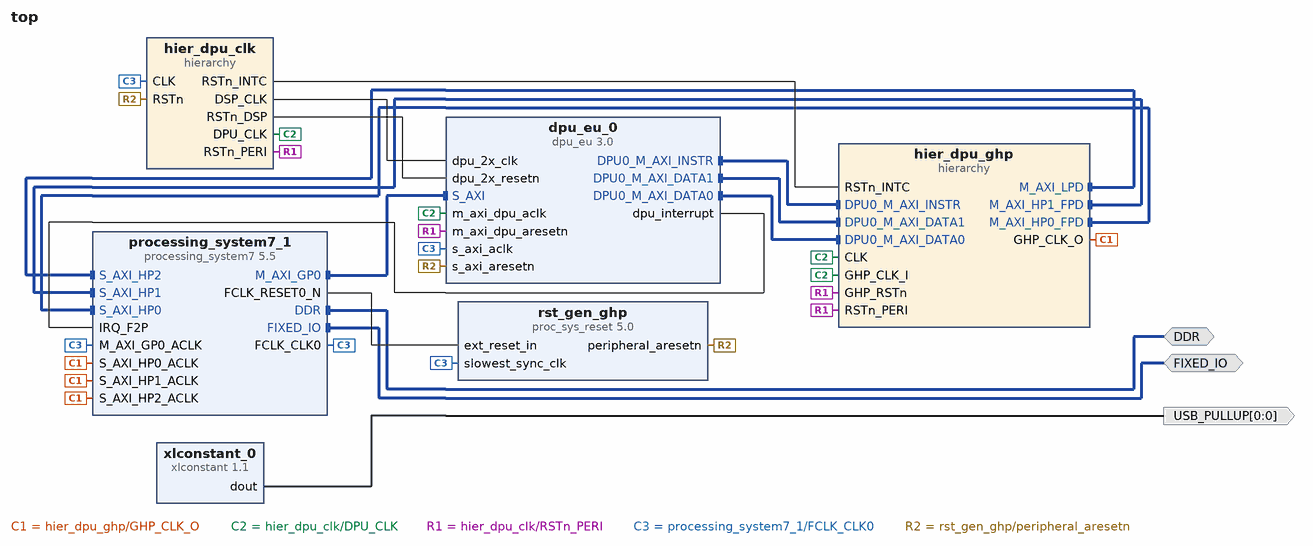
[diagram p0: block diagram of the top level]
# Vivado block design top, xc7z020clg484-1, Vivado 2019.2
create_bd_design top

create_bd_intf_port -mode Master -vlnv xilinx.com:interface:ddrx_rtl:1.0 DDR
create_bd_intf_port -mode Master -vlnv xilinx.com:display_processing_system7:fixedio_rtl:1.0 FIXED_IO
create_bd_port -dir O -from 0 -to 0 USB_PULLUP

create_bd_cell -type hier hier_dpu_clk
create_bd_cell -type hier hier_dpu_ghp
create_bd_cell -type ip -vlnv xilinx.com:ip:processing_system7:5.5 processing_system7_1
set_property -dict [list \
  CONFIG.PCW_APU_PERIPHERAL_FREQMHZ 666.666667 \
  CONFIG.PCW_ENET0_ENET0_IO {MIO 16 .. 27} \
  CONFIG.PCW_ENET0_GRP_MDIO_ENABLE 1 \
  CONFIG.PCW_ENET0_GRP_MDIO_IO {MIO 52 .. 53} \
  CONFIG.PCW_ENET0_PERIPHERAL_ENABLE 1 \
  CONFIG.PCW_ENET0_RESET_ENABLE 0 \
  CONFIG.PCW_ENET_RESET_ENABLE 1 \
  CONFIG.PCW_ENET_RESET_SELECT {Share reset pin} \
  CONFIG.PCW_FPGA0_PERIPHERAL_FREQMHZ 100 \
  CONFIG.PCW_FPGA1_PERIPHERAL_FREQMHZ 150.000000 \
  CONFIG.PCW_GPIO_MIO_GPIO_ENABLE 1 \
  CONFIG.PCW_GPIO_MIO_GPIO_IO MIO \
  CONFIG.PCW_I2C_RESET_ENABLE 1 \
  CONFIG.PCW_IRQ_F2P_INTR 1 \
  CONFIG.PCW_PRESET_BANK1_VOLTAGE {LVCMOS 1.8V} \
  CONFIG.PCW_QSPI_GRP_SINGLE_SS_ENABLE 1 \
  CONFIG.PCW_QSPI_GRP_SINGLE_SS_IO {MIO 1 .. 6} \
  CONFIG.PCW_QSPI_PERIPHERAL_ENABLE 1 \
  CONFIG.PCW_QSPI_QSPI_IO {MIO 1 .. 6} \
  CONFIG.PCW_SD0_GRP_CD_ENABLE 1 \
  CONFIG.PCW_SD0_GRP_CD_IO {MIO 47} \
  CONFIG.PCW_SD0_GRP_WP_ENABLE 1 \
  CONFIG.PCW_SD0_GRP_WP_IO {MIO 46} \
  CONFIG.PCW_SD0_PERIPHERAL_ENABLE 1 \
  CONFIG.PCW_SD0_SD0_IO {MIO 40 .. 45} \
  CONFIG.PCW_SDIO_PERIPHERAL_FREQMHZ 50 \
  CONFIG.PCW_SINGLE_QSPI_DATA_MODE x4 \
  CONFIG.PCW_TTC0_PERIPHERAL_ENABLE 1 \
  CONFIG.PCW_TTC0_TTC0_IO EMIO \
  CONFIG.PCW_UART1_PERIPHERAL_ENABLE 1 \
  CONFIG.PCW_UART1_UART1_IO {MIO 48 .. 49} \
  CONFIG.PCW_UART_PERIPHERAL_FREQMHZ 50 \
  CONFIG.PCW_UIPARAM_DDR_FREQ_MHZ 533.333313 \
  CONFIG.PCW_UIPARAM_DDR_PARTNO {MT41J128M16 HA-15E} \
  CONFIG.PCW_USB0_PERIPHERAL_ENABLE 1 \
  CONFIG.PCW_USB0_RESET_ENABLE 0 \
  CONFIG.PCW_USB0_USB0_IO {MIO 28 .. 39} \
  CONFIG.PCW_USB_RESET_ENABLE 1 \
  CONFIG.PCW_USB_RESET_SELECT {Share reset pin} \
  CONFIG.PCW_USE_FABRIC_INTERRUPT 1 \
  CONFIG.PCW_USE_S_AXI_HP0 1 \
  CONFIG.PCW_USE_S_AXI_HP1 1 \
  CONFIG.PCW_USE_S_AXI_HP2 1 \
  CONFIG.preset ZedBoard \
] [get_bd_cells processing_system7_1]
# 223 more settings of processing_system7_1 are not shown: defaults, MIO pin electricals, DDR timing, and values the tool derives
create_bd_cell -type ip -vlnv xilinx.com:ip:proc_sys_reset:5.0 rst_gen_ghp
create_bd_cell -type ip -vlnv xilinx.com:ip:xlconstant:1.1 xlconstant_0
create_bd_cell -type ip -vlnv xilinx.com:ip:dpu_eu:3.0 dpu_eu_0
set_property -dict [list \
  CONFIG.ARCH 1152 \
  CONFIG.TIME_DAY 14 \
  CONFIG.TIME_HOUR 0 \
  CONFIG.TIME_MONTH 1 \
  CONFIG.TIME_QUARTER 0 \
  CONFIG.TIME_YEAR 21 \
] [get_bd_cells dpu_eu_0]

# ---- hierarchy /hier_dpu_clk ----
current_bd_instance /hier_dpu_clk
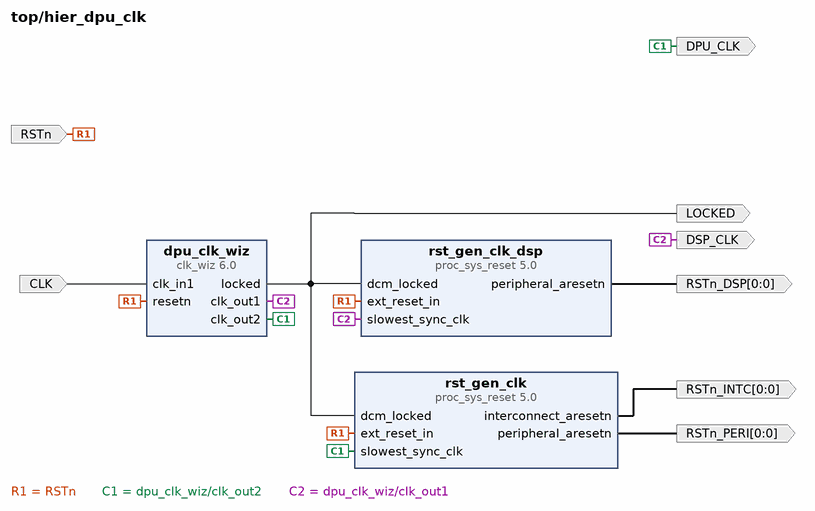
[diagram p1: block diagram inside /hier_dpu_clk]
create_bd_pin -dir I -type clk CLK
create_bd_pin -dir O -type clk DPU_CLK
create_bd_pin -dir O -type clk DSP_CLK
create_bd_pin -dir O -type data LOCKED
create_bd_pin -dir I -type rst RSTn
create_bd_pin -dir O -from 0 -to 0 -type rst RSTn_DSP
create_bd_pin -dir O -from 0 -to 0 -type rst RSTn_INTC
create_bd_pin -dir O -from 0 -to 0 -type rst RSTn_PERI

create_bd_cell -type ip -vlnv xilinx.com:ip:clk_wiz:6.0 dpu_clk_wiz
set_property -dict [list \
  CONFIG.CLKIN1_JITTER_PS 100.0 \
  CONFIG.CLKOUT1_DRIVES BUFG \
  CONFIG.CLKOUT1_JITTER 224.262 \
  CONFIG.CLKOUT1_PHASE_ERROR 296.868 \
  CONFIG.CLKOUT1_REQUESTED_OUT_FREQ 180 \
  CONFIG.CLKOUT2_DRIVES BUFG \
  CONFIG.CLKOUT2_JITTER 247.412 \
  CONFIG.CLKOUT2_PHASE_ERROR 296.868 \
  CONFIG.CLKOUT2_REQUESTED_OUT_FREQ 90 \
  CONFIG.CLKOUT2_USED true \
  CONFIG.CLKOUT3_DRIVES BUFG \
  CONFIG.CLKOUT4_DRIVES BUFG \
  CONFIG.CLKOUT5_DRIVES BUFG \
  CONFIG.CLKOUT6_DRIVES BUFG \
  CONFIG.CLKOUT7_DRIVES BUFG \
  CONFIG.MMCM_CLKFBOUT_MULT_F 49.500 \
  CONFIG.MMCM_CLKIN1_PERIOD 10.000 \
  CONFIG.MMCM_CLKOUT0_DIVIDE_F 5.500 \
  CONFIG.MMCM_CLKOUT1_DIVIDE 11 \
  CONFIG.MMCM_DIVCLK_DIVIDE 5 \
  CONFIG.NUM_OUT_CLKS 2 \
  CONFIG.RESET_PORT resetn \
  CONFIG.RESET_TYPE ACTIVE_LOW \
  CONFIG.SECONDARY_SOURCE Single_ended_clock_capable_pin \
  CONFIG.USE_PHASE_ALIGNMENT true \
] [get_bd_cells dpu_clk_wiz]
create_bd_cell -type ip -vlnv xilinx.com:ip:proc_sys_reset:5.0 rst_gen_clk
create_bd_cell -type ip -vlnv xilinx.com:ip:proc_sys_reset:5.0 rst_gen_clk_dsp

# ---- hierarchy /hier_dpu_ghp ----
current_bd_instance /hier_dpu_ghp
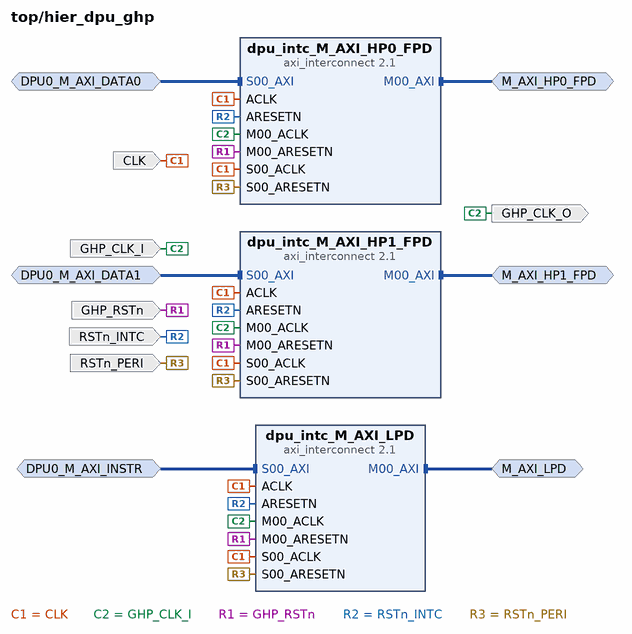
[diagram p2: block diagram inside /hier_dpu_ghp]
create_bd_intf_pin -mode Slave -vlnv xilinx.com:interface:aximm_rtl:1.0 DPU0_M_AXI_DATA0
create_bd_intf_pin -mode Slave -vlnv xilinx.com:interface:aximm_rtl:1.0 DPU0_M_AXI_DATA1
create_bd_intf_pin -mode Slave -vlnv xilinx.com:interface:aximm_rtl:1.0 DPU0_M_AXI_INSTR
create_bd_intf_pin -mode Master -vlnv xilinx.com:interface:aximm_rtl:1.0 M_AXI_HP0_FPD
create_bd_intf_pin -mode Master -vlnv xilinx.com:interface:aximm_rtl:1.0 M_AXI_HP1_FPD
create_bd_intf_pin -mode Master -vlnv xilinx.com:interface:aximm_rtl:1.0 M_AXI_LPD
create_bd_pin -dir I -type clk CLK
create_bd_pin -dir I -type clk GHP_CLK_I
create_bd_pin -dir O -type clk GHP_CLK_O
create_bd_pin -dir I -type rst GHP_RSTn
create_bd_pin -dir I -type rst RSTn_INTC
create_bd_pin -dir I -type rst RSTn_PERI

create_bd_cell -type ip -vlnv xilinx.com:ip:axi_interconnect:2.1 dpu_intc_M_AXI_HP0_FPD
set_property -dict {CONFIG.NUM_MI 1 CONFIG.NUM_SI 1} [get_bd_cells dpu_intc_M_AXI_HP0_FPD]
create_bd_cell -type ip -vlnv xilinx.com:ip:axi_interconnect:2.1 dpu_intc_M_AXI_HP1_FPD
set_property -dict {CONFIG.NUM_MI 1 CONFIG.NUM_SI 1} [get_bd_cells dpu_intc_M_AXI_HP1_FPD]
create_bd_cell -type ip -vlnv xilinx.com:ip:axi_interconnect:2.1 dpu_intc_M_AXI_LPD
set_property -dict {CONFIG.NUM_MI 1 CONFIG.NUM_SI 1} [get_bd_cells dpu_intc_M_AXI_LPD]

# ---- connections ----

current_bd_instance /hier_dpu_clk
connect_bd_net [get_bd_pins CLK] [get_bd_pins dpu_clk_wiz/clk_in1]
connect_bd_net [get_bd_pins RSTn] [get_bd_pins dpu_clk_wiz/resetn] [get_bd_pins rst_gen_clk/ext_reset_in] [get_bd_pins rst_gen_clk_dsp/ext_reset_in]
connect_bd_net -net dpu_clk_wiz_clk_dpu [get_bd_pins dpu_clk_wiz/clk_out2] [get_bd_pins DPU_CLK] [get_bd_pins rst_gen_clk/slowest_sync_clk]
connect_bd_net -net dpu_clk_wiz_clk_dsp [get_bd_pins dpu_clk_wiz/clk_out1] [get_bd_pins DSP_CLK] [get_bd_pins rst_gen_clk_dsp/slowest_sync_clk]
connect_bd_net [get_bd_pins dpu_clk_wiz/locked] [get_bd_pins LOCKED] [get_bd_pins rst_gen_clk/dcm_locked] [get_bd_pins rst_gen_clk_dsp/dcm_locked]
connect_bd_net [get_bd_pins rst_gen_clk_dsp/peripheral_aresetn] [get_bd_pins RSTn_DSP]
connect_bd_net [get_bd_pins rst_gen_clk/interconnect_aresetn] [get_bd_pins RSTn_INTC]
connect_bd_net [get_bd_pins rst_gen_clk/peripheral_aresetn] [get_bd_pins RSTn_PERI]

current_bd_instance /hier_dpu_ghp
connect_bd_intf_net [get_bd_intf_pins DPU0_M_AXI_INSTR] [get_bd_intf_pins dpu_intc_M_AXI_LPD/S00_AXI]
connect_bd_intf_net -intf_net DPU0_M_AXI_DATA1_1 [get_bd_intf_pins DPU0_M_AXI_DATA1] [get_bd_intf_pins dpu_intc_M_AXI_HP1_FPD/S00_AXI]
connect_bd_intf_net [get_bd_intf_pins M_AXI_HP1_FPD] [get_bd_intf_pins dpu_intc_M_AXI_HP1_FPD/M00_AXI]
connect_bd_intf_net [get_bd_intf_pins M_AXI_LPD] [get_bd_intf_pins dpu_intc_M_AXI_LPD/M00_AXI]
connect_bd_intf_net [get_bd_intf_pins M_AXI_HP0_FPD] [get_bd_intf_pins dpu_intc_M_AXI_HP0_FPD/M00_AXI]
connect_bd_intf_net -intf_net DPU0_M_AXI_DATA0_1 [get_bd_intf_pins DPU0_M_AXI_DATA0] [get_bd_intf_pins dpu_intc_M_AXI_HP0_FPD/S00_AXI]
connect_bd_net [get_bd_pins CLK] \
  [get_bd_pins dpu_intc_M_AXI_HP0_FPD/ACLK] [get_bd_pins dpu_intc_M_AXI_HP0_FPD/S00_ACLK] \
  [get_bd_pins dpu_intc_M_AXI_HP1_FPD/ACLK] [get_bd_pins dpu_intc_M_AXI_HP1_FPD/S00_ACLK] \
  [get_bd_pins dpu_intc_M_AXI_LPD/ACLK] [get_bd_pins dpu_intc_M_AXI_LPD/S00_ACLK]
connect_bd_net [get_bd_pins GHP_CLK_I] \
  [get_bd_pins GHP_CLK_O] [get_bd_pins dpu_intc_M_AXI_HP0_FPD/M00_ACLK] [get_bd_pins dpu_intc_M_AXI_HP1_FPD/M00_ACLK] \
  [get_bd_pins dpu_intc_M_AXI_LPD/M00_ACLK]
connect_bd_net [get_bd_pins GHP_RSTn] \
  [get_bd_pins dpu_intc_M_AXI_HP0_FPD/M00_ARESETN] [get_bd_pins dpu_intc_M_AXI_HP1_FPD/M00_ARESETN] \
  [get_bd_pins dpu_intc_M_AXI_LPD/M00_ARESETN]
connect_bd_net [get_bd_pins RSTn_INTC] \
  [get_bd_pins dpu_intc_M_AXI_HP0_FPD/ARESETN] [get_bd_pins dpu_intc_M_AXI_HP1_FPD/ARESETN] \
  [get_bd_pins dpu_intc_M_AXI_LPD/ARESETN]
connect_bd_net [get_bd_pins RSTn_PERI] \
  [get_bd_pins dpu_intc_M_AXI_HP0_FPD/S00_ARESETN] [get_bd_pins dpu_intc_M_AXI_HP1_FPD/S00_ARESETN] \
  [get_bd_pins dpu_intc_M_AXI_LPD/S00_ARESETN]

current_bd_instance /
connect_bd_intf_net -intf_net hier_dpu_M_AXI_LPD [get_bd_intf_pins hier_dpu_ghp/M_AXI_LPD] [get_bd_intf_pins processing_system7_1/S_AXI_HP2]
connect_bd_intf_net -intf_net hier_dpu_M_AXI_HP1_FPD [get_bd_intf_pins hier_dpu_ghp/M_AXI_HP1_FPD] [get_bd_intf_pins processing_system7_1/S_AXI_HP1]
connect_bd_intf_net -intf_net hier_dpu_M_AXI_HP0_FPD [get_bd_intf_pins hier_dpu_ghp/M_AXI_HP0_FPD] [get_bd_intf_pins processing_system7_1/S_AXI_HP0]
connect_bd_intf_net [get_bd_intf_ports DDR] [get_bd_intf_pins processing_system7_1/DDR]
connect_bd_intf_net [get_bd_intf_ports FIXED_IO] [get_bd_intf_pins processing_system7_1/FIXED_IO]
connect_bd_intf_net [get_bd_intf_pins dpu_eu_0/DPU0_M_AXI_INSTR] [get_bd_intf_pins hier_dpu_ghp/DPU0_M_AXI_INSTR]
connect_bd_intf_net [get_bd_intf_pins dpu_eu_0/DPU0_M_AXI_DATA1] [get_bd_intf_pins hier_dpu_ghp/DPU0_M_AXI_DATA1]
connect_bd_intf_net [get_bd_intf_pins dpu_eu_0/DPU0_M_AXI_DATA0] [get_bd_intf_pins hier_dpu_ghp/DPU0_M_AXI_DATA0]
connect_bd_intf_net [get_bd_intf_pins processing_system7_1/M_AXI_GP0] [get_bd_intf_pins dpu_eu_0/S_AXI]
connect_bd_net -net hier_dpu_GHP_CLK_O [get_bd_pins hier_dpu_ghp/GHP_CLK_O] \
  [get_bd_pins processing_system7_1/S_AXI_HP0_ACLK] [get_bd_pins processing_system7_1/S_AXI_HP1_ACLK] \
  [get_bd_pins processing_system7_1/S_AXI_HP2_ACLK]
connect_bd_net [get_bd_pins hier_dpu_clk/DPU_CLK] \
  [get_bd_pins hier_dpu_ghp/CLK] [get_bd_pins hier_dpu_ghp/GHP_CLK_I] [get_bd_pins dpu_eu_0/m_axi_dpu_aclk]
connect_bd_net [get_bd_pins hier_dpu_clk/DSP_CLK] [get_bd_pins dpu_eu_0/dpu_2x_clk]
connect_bd_net [get_bd_pins hier_dpu_clk/RSTn_DSP] [get_bd_pins dpu_eu_0/dpu_2x_resetn]
connect_bd_net [get_bd_pins hier_dpu_clk/RSTn_INTC] [get_bd_pins hier_dpu_ghp/RSTn_INTC]
connect_bd_net [get_bd_pins hier_dpu_clk/RSTn_PERI] \
  [get_bd_pins hier_dpu_ghp/GHP_RSTn] [get_bd_pins hier_dpu_ghp/RSTn_PERI] [get_bd_pins dpu_eu_0/m_axi_dpu_aresetn]
connect_bd_net -net processing_system7_0_FCLK_CLK0 [get_bd_pins processing_system7_1/FCLK_CLK0] \
  [get_bd_pins hier_dpu_clk/CLK] [get_bd_pins processing_system7_1/M_AXI_GP0_ACLK] [get_bd_pins rst_gen_ghp/slowest_sync_clk] \
  [get_bd_pins dpu_eu_0/s_axi_aclk]
connect_bd_net [get_bd_pins processing_system7_1/FCLK_RESET0_N] [get_bd_pins rst_gen_ghp/ext_reset_in]
connect_bd_net [get_bd_pins rst_gen_ghp/peripheral_aresetn] [get_bd_pins hier_dpu_clk/RSTn] [get_bd_pins dpu_eu_0/s_axi_aresetn]
connect_bd_net [get_bd_pins xlconstant_0/dout] [get_bd_ports USB_PULLUP]
connect_bd_net [get_bd_pins dpu_eu_0/dpu_interrupt] [get_bd_pins processing_system7_1/IRQ_F2P]

validate_bd_design
save_bd_design
